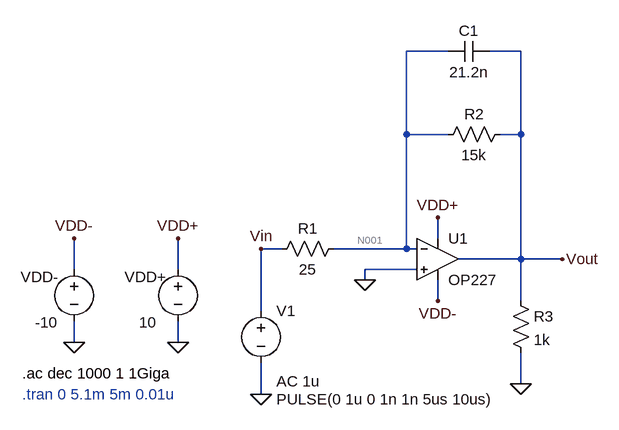
[diagram p0: schematic q6.asc]
q6.asc, the LTspice schematic file:
Version 4.1
SHEET 1 880 680
WIRE 208 -160 144 -160
WIRE 320 -160 272 -160
WIRE 144 -32 144 -160
WIRE 208 -32 144 -32
WIRE 320 -32 320 -160
WIRE 320 -32 288 -32
WIRE 192 128 192 96
WIRE -48 144 -80 144
WIRE 144 144 144 -32
WIRE 144 144 32 144
WIRE 160 144 144 144
WIRE 320 160 320 -32
WIRE 320 160 224 160
WIRE 384 160 320 160
WIRE -368 176 -368 128
WIRE -208 176 -208 128
WIRE 160 176 80 176
WIRE 80 192 80 176
WIRE 192 224 192 192
WIRE 320 224 320 160
WIRE -80 240 -80 144
WIRE -368 288 -368 256
WIRE -208 288 -208 256
WIRE 320 352 320 304
WIRE -80 368 -80 320
FLAG -368 288 0
FLAG 384 160 Vout
FLAG -208 288 0
FLAG -368 128 VDD-
FLAG -208 128 VDD+
FLAG 192 96 VDD+
FLAG 192 224 VDD-
FLAG 320 352 0
FLAG 80 192 0
FLAG -80 368 0
FLAG -80 144 Vin
SYMBOL voltage -368 160 R0
WINDOW 0 -82 27 Left 2
WINDOW 3 -60 97 Left 2
WINDOW 123 0 0 Left 0
WINDOW 39 0 0 Left 0
SYMATTR InstName VDD-
SYMATTR Value -10
SYMBOL voltage -208 160 R0
WINDOW 0 -82 27 Left 2
WINDOW 3 -60 97 Left 2
WINDOW 123 0 0 Left 0
WINDOW 39 0 0 Left 0
SYMATTR InstName VDD+
SYMATTR Value 10
SYMBOL OpAmps\\OP227 192 96 R0
SYMATTR InstName U1
SYMBOL res 304 -48 R90
WINDOW 0 0 56 VBottom 2
WINDOW 3 32 56 VTop 2
SYMATTR InstName R2
SYMATTR Value 15k
SYMBOL res 48 128 R90
WINDOW 0 0 56 VBottom 2
WINDOW 3 32 56 VTop 2
SYMATTR InstName R1
SYMATTR Value 25
SYMBOL res 304 208 R0
SYMATTR InstName R3
SYMATTR Value 1k
SYMBOL cap 272 -176 R90
WINDOW 0 0 32 VBottom 2
WINDOW 3 32 32 VTop 2
SYMATTR InstName C1
SYMATTR Value 21.2n
SYMBOL voltage -80 224 R0
WINDOW 3 24 152 Left 2
WINDOW 123 24 124 Left 2
WINDOW 39 0 0 Left 0
SYMATTR Value PULSE(0 1u 0 1n 1n 5us 10us)
SYMATTR Value2 AC 1u
SYMATTR InstName V1
TEXT -448 336 Left 2 !.ac dec 1000 1 1Giga
TEXT -448 368 Left 2 ;.tran 0 5.1m 5m 0.01u

The netlist it stands for:
* q6.asc
VDD- VDD- 0 -10
VDD+ VDD+ 0 10
X§U1 0 N001 VDD+ VDD- Vout OP227  ; pins In+ In- V+ V- OUT
R2 Vout N001 15k
R1 N001 Vin 25
R3 Vout 0 1k
C1 Vout N001 21.2n
V1 Vin 0 PULSE(0 1u 0 1n 1n 5us 10us) AC 1u
.ac dec 1000 1 1Giga
* .tran 0 5.1m 5m 0.01u
.backanno
.end

* Results of the author's LTspice run, read from the files saved beside the schematic
* Operating Point, zero values left out:
*   V(vdd+) = 10 V
*   V(vdd-) = -10 V
*   I(VDD-) = 2.718 mA
*   I(VDD+) = -2.718 mA
*   Ix(u1:3) = 2.718 mA
*   Ix(u1:4) = -2.718 mA
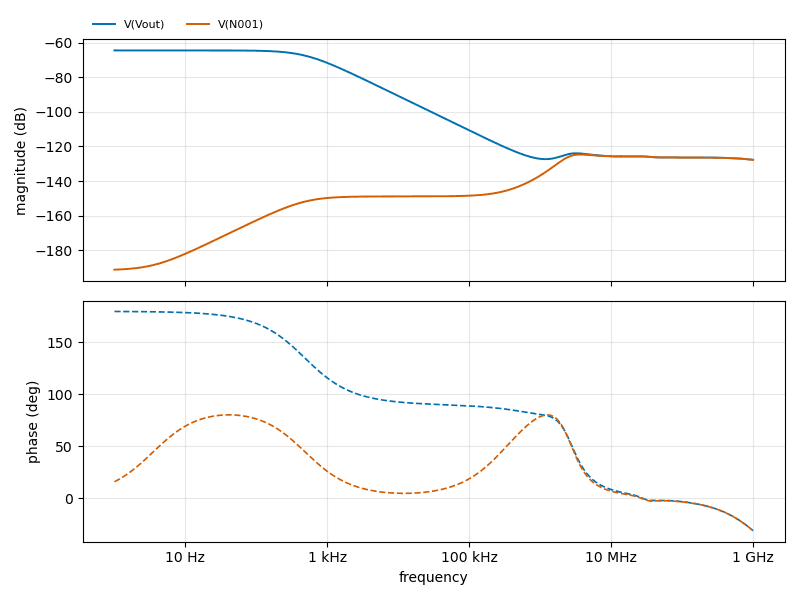
[diagram p1: AC Analysis of q6.asc, plotted from the saved traces]
* AC Analysis, 1 run:
*   V(Vout): -64.44 dB at 1 Hz, -127.76 dB at 1 GHz, peak -64.44 dB at 1 Hz, 3 dB below the peak at 482.7 Hz
*   V(N001): -191.28 dB at 1 Hz, -127.75 dB at 1 GHz, peak -124.67 dB at 3.681 MHz, 3 dB below the peak at 2.109 MHz and 968.3 MHz